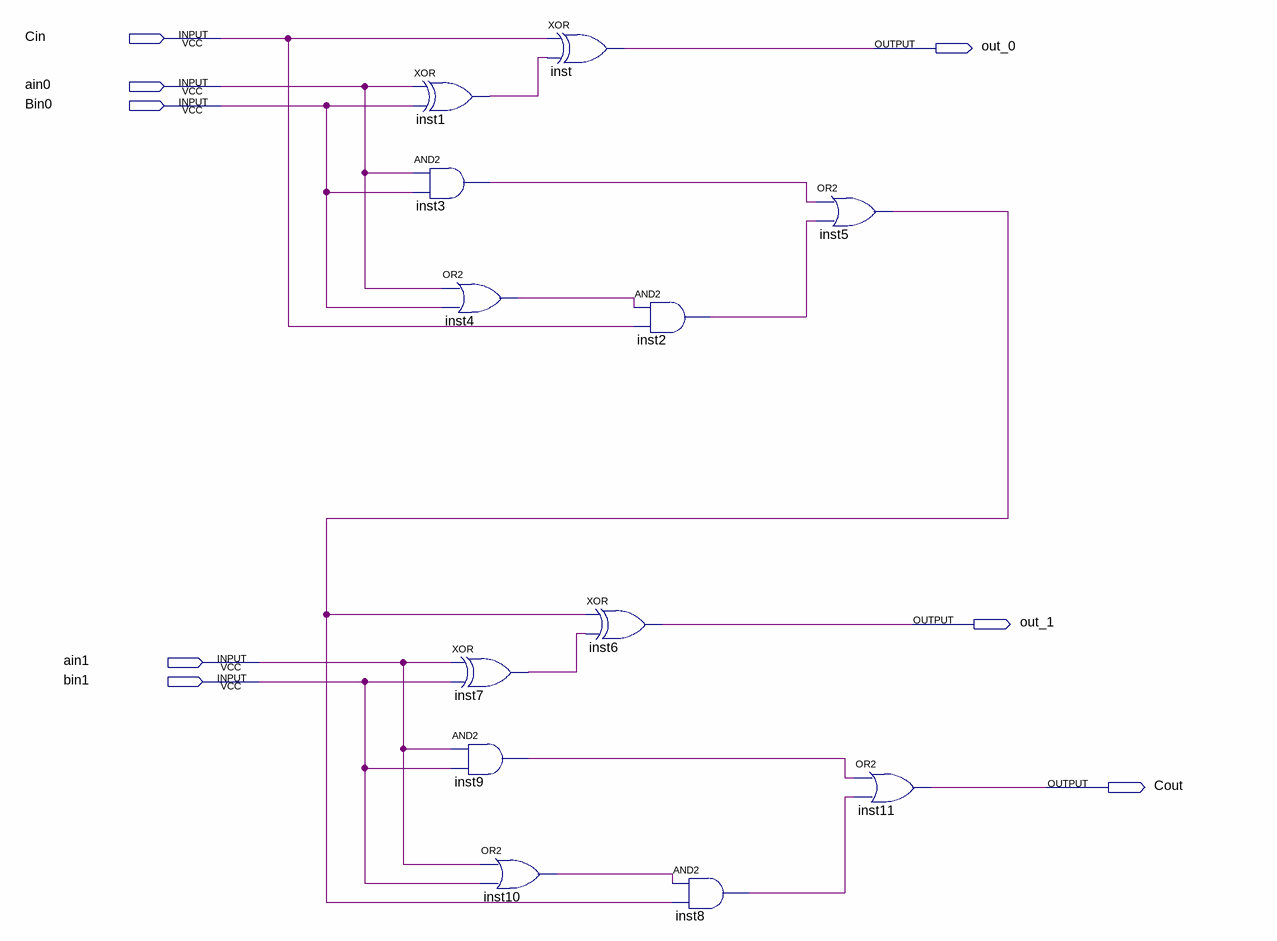
[diagram p0: schematic sheet]
// Quartus schematic Somador.bdf as structural Verilog: 12 symbols, 8 pins
module Somador (
  input  Cin,
  input  ain0,
  input  Bin0,
  input  ain1,
  input  bin1,
  output out_0,
  output out_1,
  output Cout
);

  wire inst1_out, inst2_out, inst3_out, inst4_out, inst5_out, inst7_out, inst8_out, inst9_out, inst10_out;

  xor inst1 (inst1_out, ain0, Bin0);
  and inst3 (inst3_out, ain0, Bin0);
  or inst4 (inst4_out, ain0, Bin0);
  xor inst7 (inst7_out, ain1, bin1);
  and inst9 (inst9_out, ain1, bin1);
  or inst10 (inst10_out, ain1, bin1);
  xor inst (out_0, Cin, inst1_out);
  xor inst6 (out_1, inst5_out, inst7_out);
  and inst2 (inst2_out, inst4_out, Cin);
  and inst8 (inst8_out, inst10_out, inst5_out);
  or inst5 (inst5_out, inst3_out, inst2_out);
  or inst11 (Cout, inst9_out, inst8_out);
endmodule
